# Altium schematic sheet DM2080_BMI270.SchDoc: =project_title
size Tabloid; CompanyName: Luxonis Holding; Organization: Luxonis Holding; Address1: 1925 Harmony Park Drive; Address2: Westminster, CO; Address3: 80234; Address4: United States; SheetNumber: 9; SheetTotal: 9
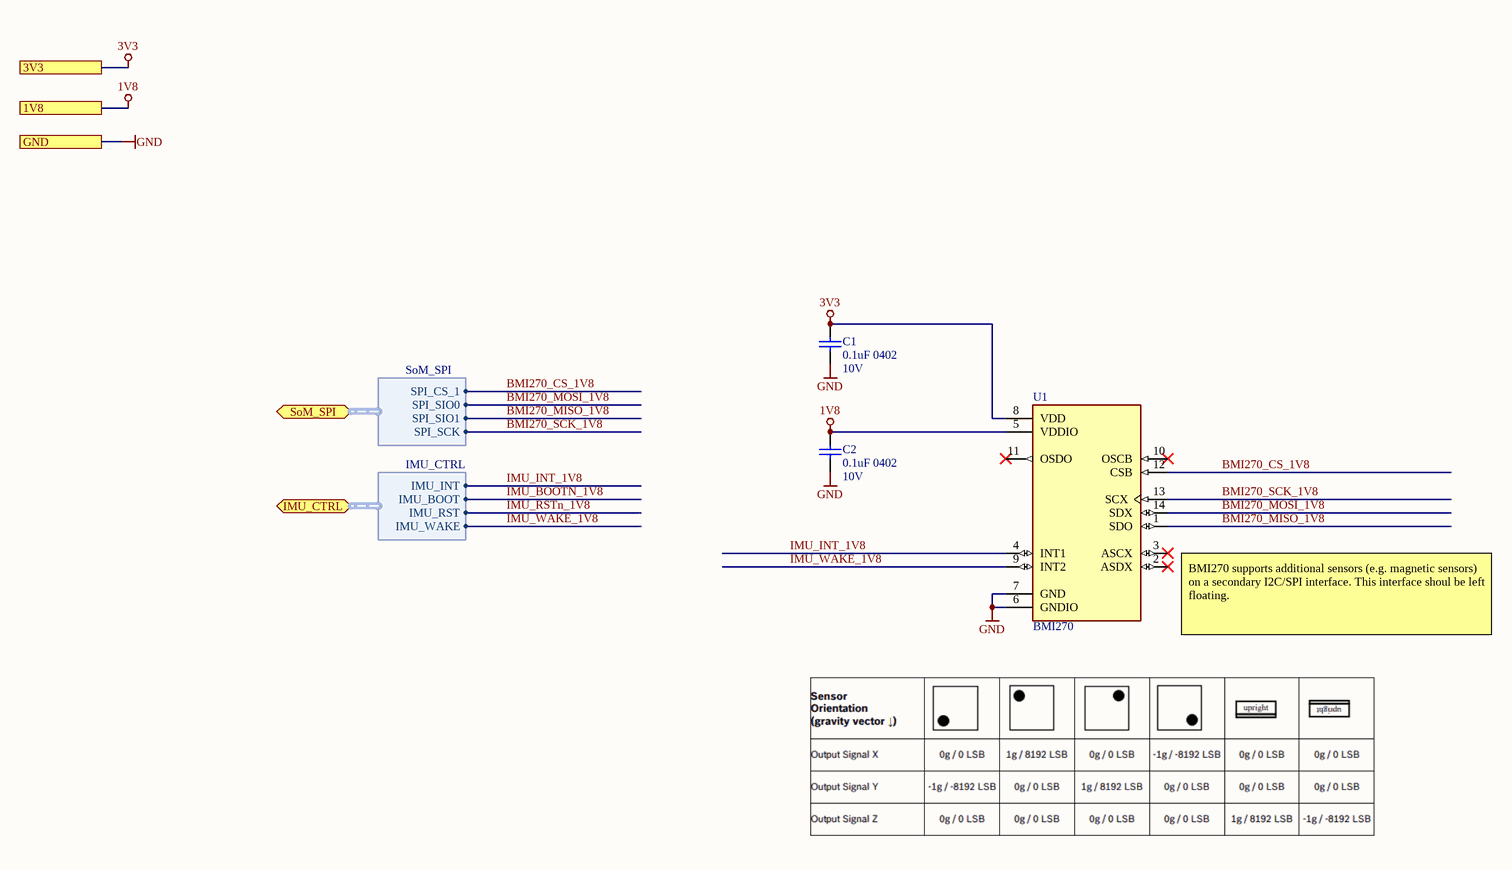
[diagram p0: DM2080_BMI270.SchDoc]

## Parts
C1  0.1uF 0402  Voltage Rating: 10V  [CAPC0402(1005)70_L]
C2  0.1uF 0402  Voltage Rating: 10V  [CAPC0402(1005)70_L]
U1  BMI270  [XDCR_BMI270]

## Ports
1V8, 3V3, GND, IMU_CTRL (bidir, harness IMU_CTRL), SoM_SPI (bidir, harness SoM_SPI)

## Harnesses
SoM_SPI: SPI_SIO0, SPI_SIO1, SPI_CS_1, SPI_SCK
IMU_CTRL: IMU_BOOT, IMU_RST, IMU_INT, IMU_WAKE

## Nets
1V8: C2.2 U1.5(VDDIO) ; port 1V8
3V3: C1.2 U1.8(VDD) ; port 3V3
GND: C1.1 C2.1 U1.6(GNDIO) U1.7(GND) ; port GND
BMI270_CS_1V8: U1.12(CSB) ; port SoM_SPI.SPI_CS_1
BMI270_MISO_1V8: U1.1(SDO) ; port SoM_SPI.SPI_SIO1
BMI270_MOSI_1V8: U1.14(SDX) ; port SoM_SPI.SPI_SIO0
BMI270_SCK_1V8: U1.13(SCX) ; port SoM_SPI.SPI_SCK
IMU_BOOTN_1V8: port IMU_CTRL.IMU_BOOT
IMU_INT_1V8: U1.4(INT1) ; port IMU_CTRL.IMU_INT
IMU_RSTn_1V8: port IMU_CTRL.IMU_RST
IMU_WAKE_1V8: U1.9(INT2) ; port IMU_CTRL.IMU_WAKE

Not connected (* = marked no-connect by the designer): U1 2(ASDX)* 3(ASCX)* 10(OSCB)* 11(OSDO)*

## Notes on the sheet
- (near U1) BMI270 supports additional sensors (e.g. magnetic sensors) on a secondary I2C/SPI interface. This interface shoul be left floating.
- Title
- Size:
- Date:
- Tabloid
- Number:
- Time:
- Revision:
- Sheet
- of
- Drawn by:

## Library data of the parts
C1 C2 = GRM155R71A104JA01D: CAP CER 0.1UF 10V X7R 0402 5%; Manufacturer 1: Murata; Capacitance: 100nF; Supplier 1: Digi-Key; Manufacturer Part Number 1: GRM155R71A104JA01D; Stock 1: 1346709; Pricing 1: 1=0.10000, 10=0.02500, 100=0.01130, 500=0.00806, 1000=0.00633, 2500=0.00575, 5000=0.00529 (USD); RoHS: Yes; Mount: Surface Mount; Case/Package: 0402; Case Code (Imperial): 0402; Case Code (Metric): 1005; Min Operating Temperature: -55°C; Max Operating Temperature: 125°C; Tolerance: 5%; Packaging: Tape and Reel; Voltage Rating (DC): 10V; Dielectric: X7R; Package Quantity: 10000; Termination: SMD/SMT; Length: 1mm; Height: 0.5mm; Width: 0.02inch; Thickness: 0.022inch; Depth: 0.5mm; Radiation Hardening: No; Lead Free: Lead Free; ComponentLink1URL: https://datasheet.ciiva.com/5411/product-5411135.pdf?src-supplier=Mouser; ComponentLink1Description: https://datasheet.ciiva.com/5411/product-5411135.pdf?src-supplier=Mouser; ComponentLink2URL: https://datasheet.ciiva.com/11618/c02e-11618821.pdf?src-supplier=Avnet; ComponentLink2Description: https://datasheet.ciiva.com/11618/c02e-11618821.pdf?src-supplier=Avnet; Supplier Part Number 1: 490-10777-1-ND
U1 = BMI270: Accelerometer, Gyroscope, 6 Axis Sensor IÂ²C, SPI Output; Manufacturer 1: Bosch Sensortec; Price: None; SnapEDA_Link: https://www.snapeda.com/parts/BMI270/Bosch%20Sensortec/view-part/3595167/?ref=snap; Manufacturer Part Number 1: BMI270; Availability: Unavailable; Value: *; Package: LGA-14 Bosch Sensortec